# EAGLE board Bottom_PCB (EAGLE 9.7.0), part 1 of 2
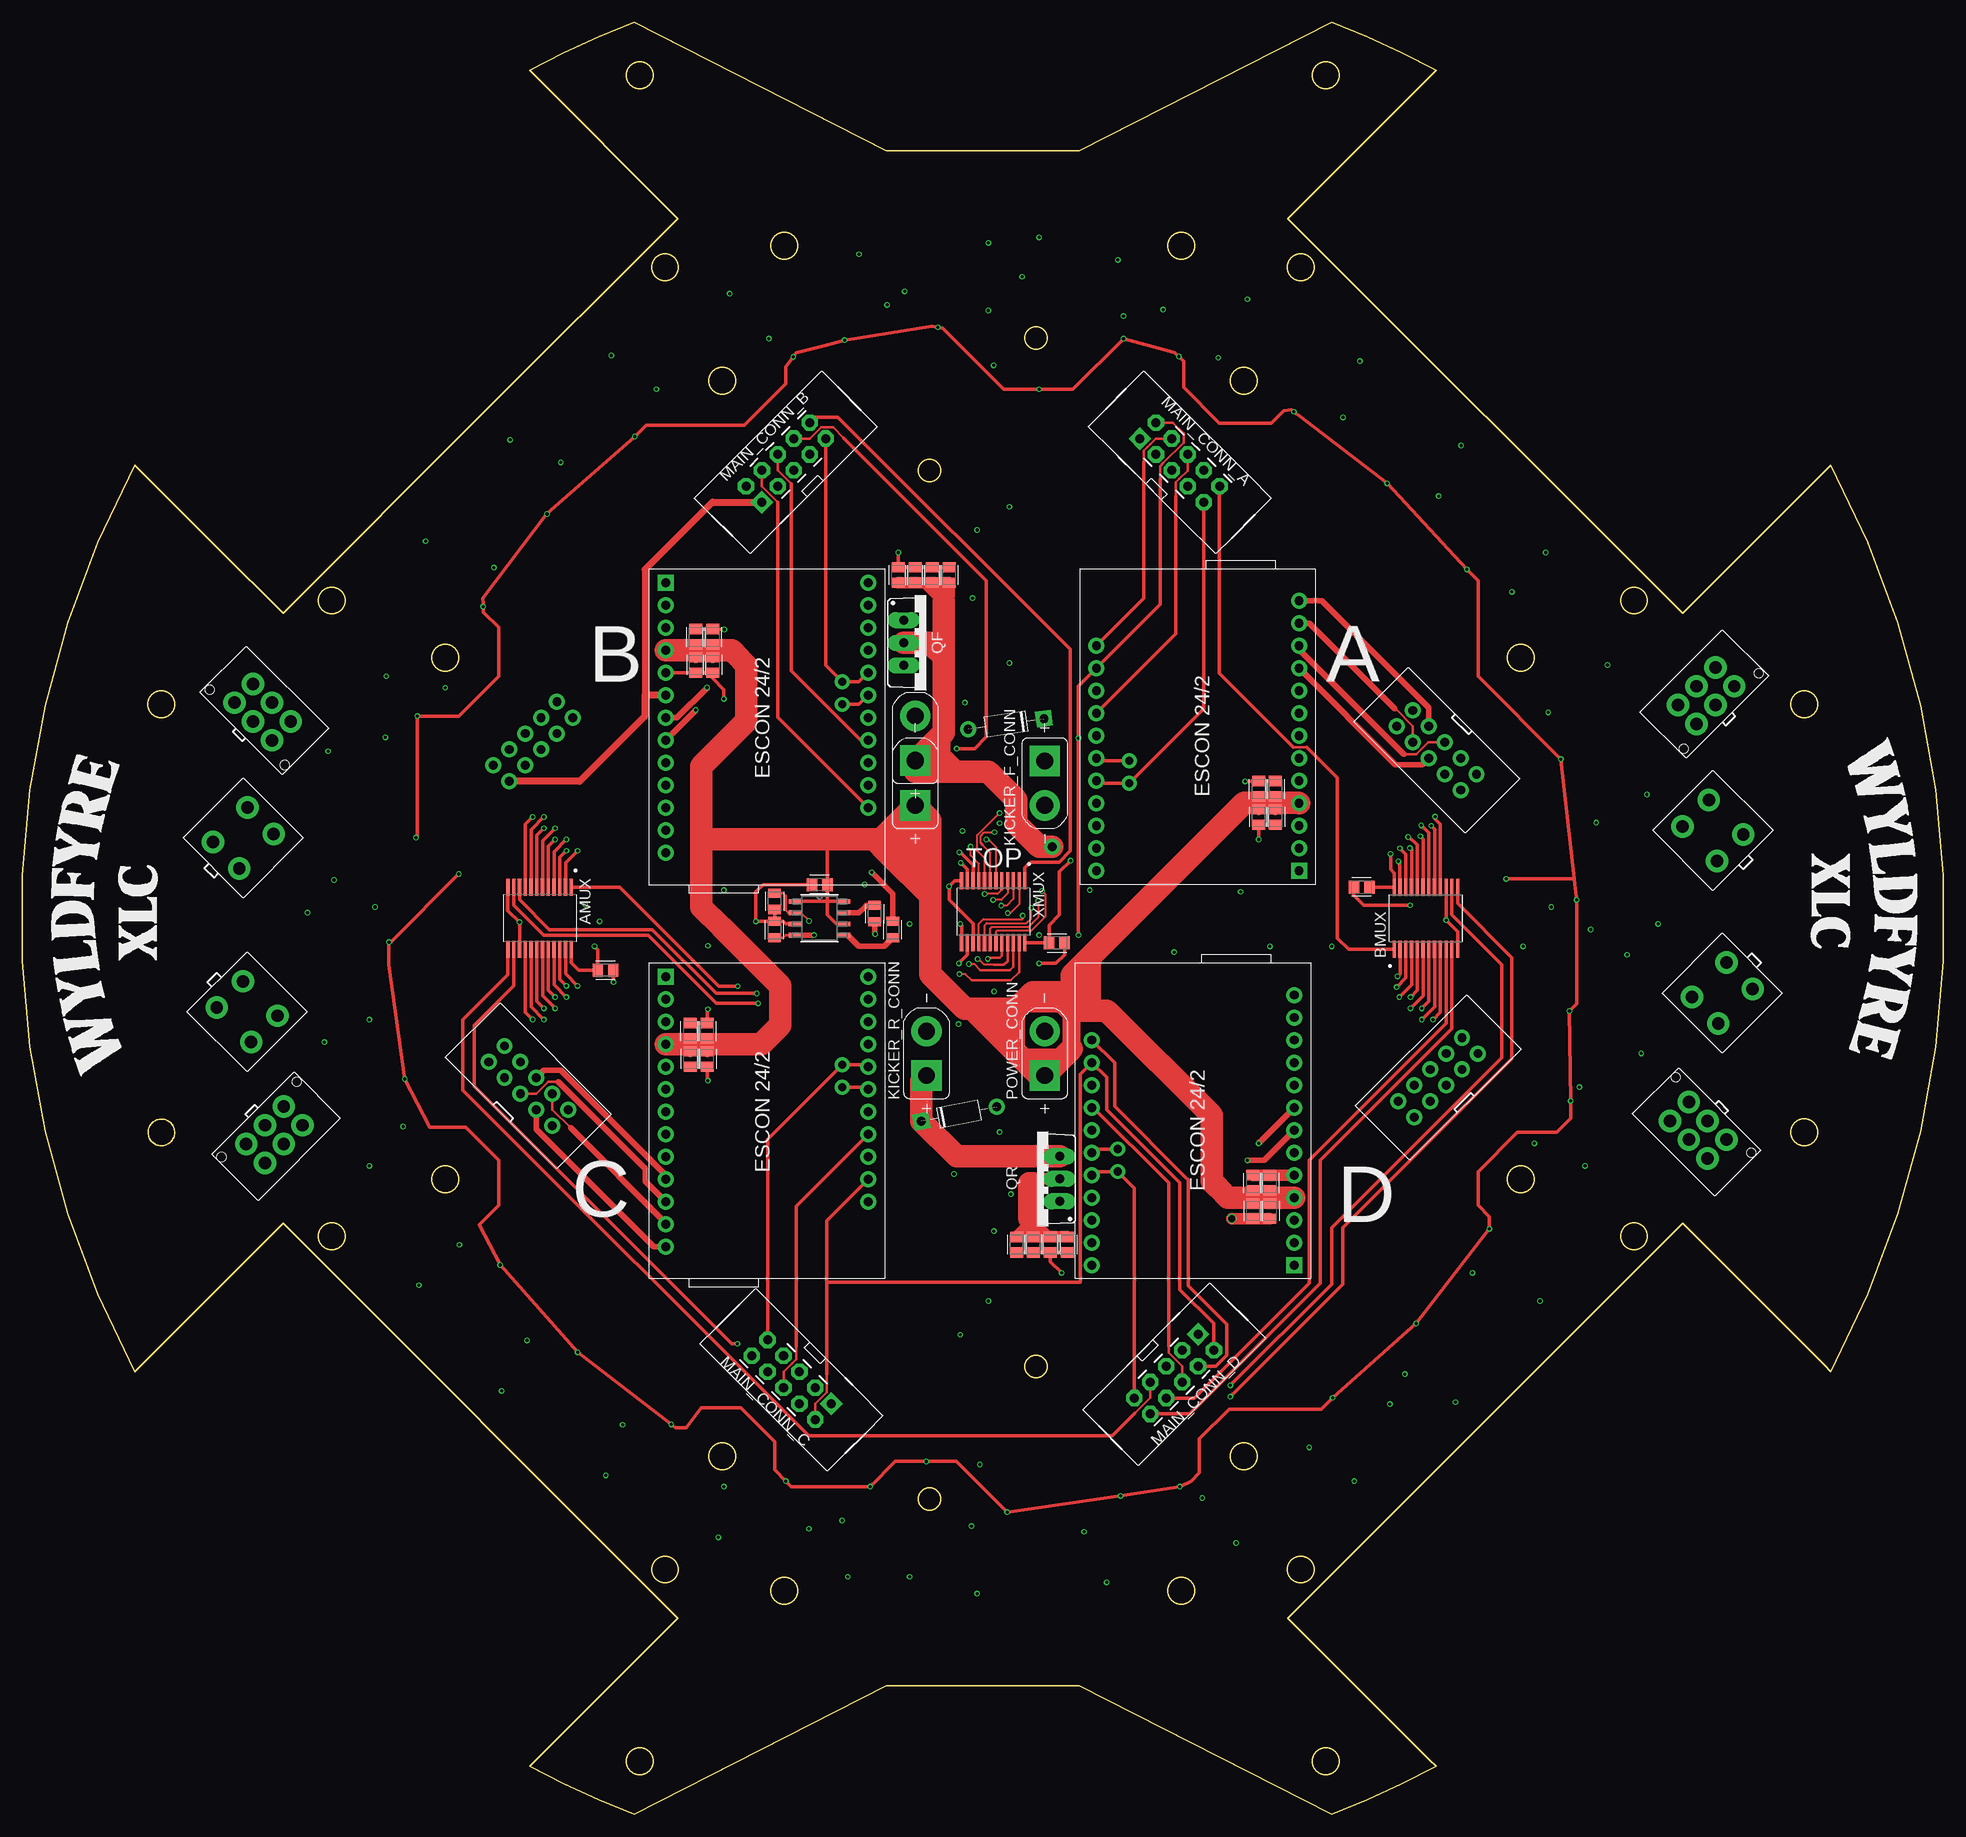
[diagram p5: board, top side]
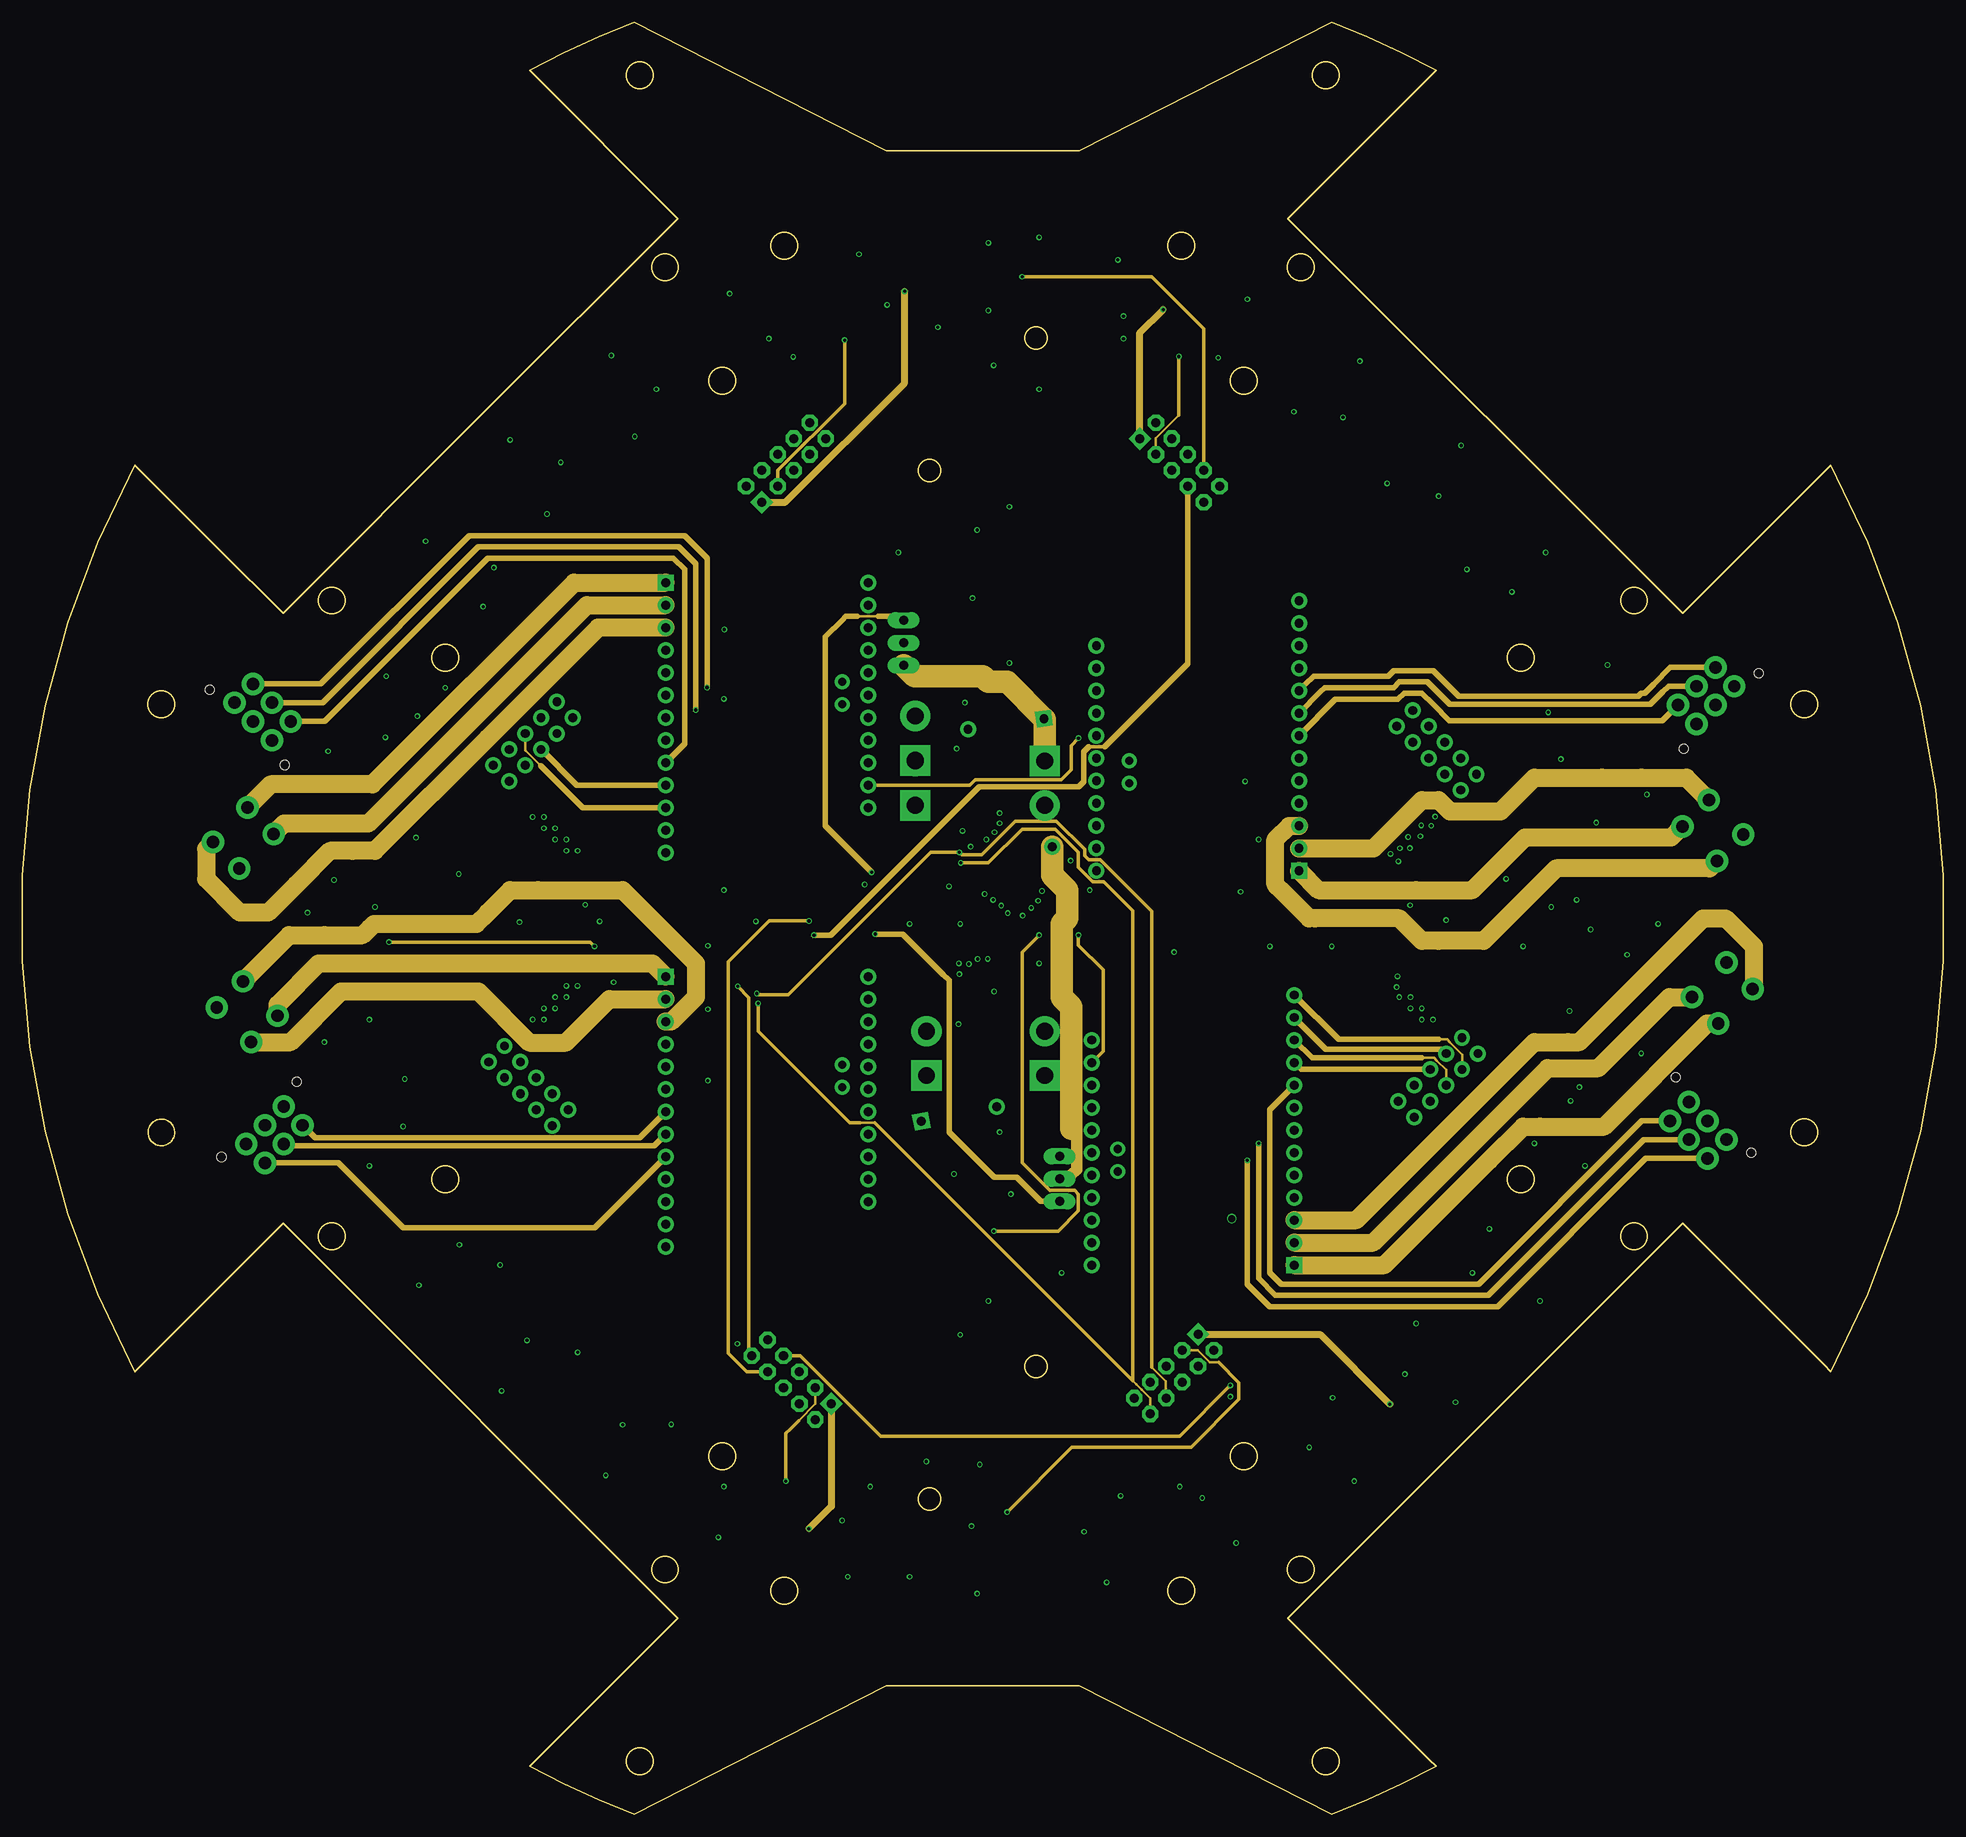
[diagram p6: board, inner layer Route2]
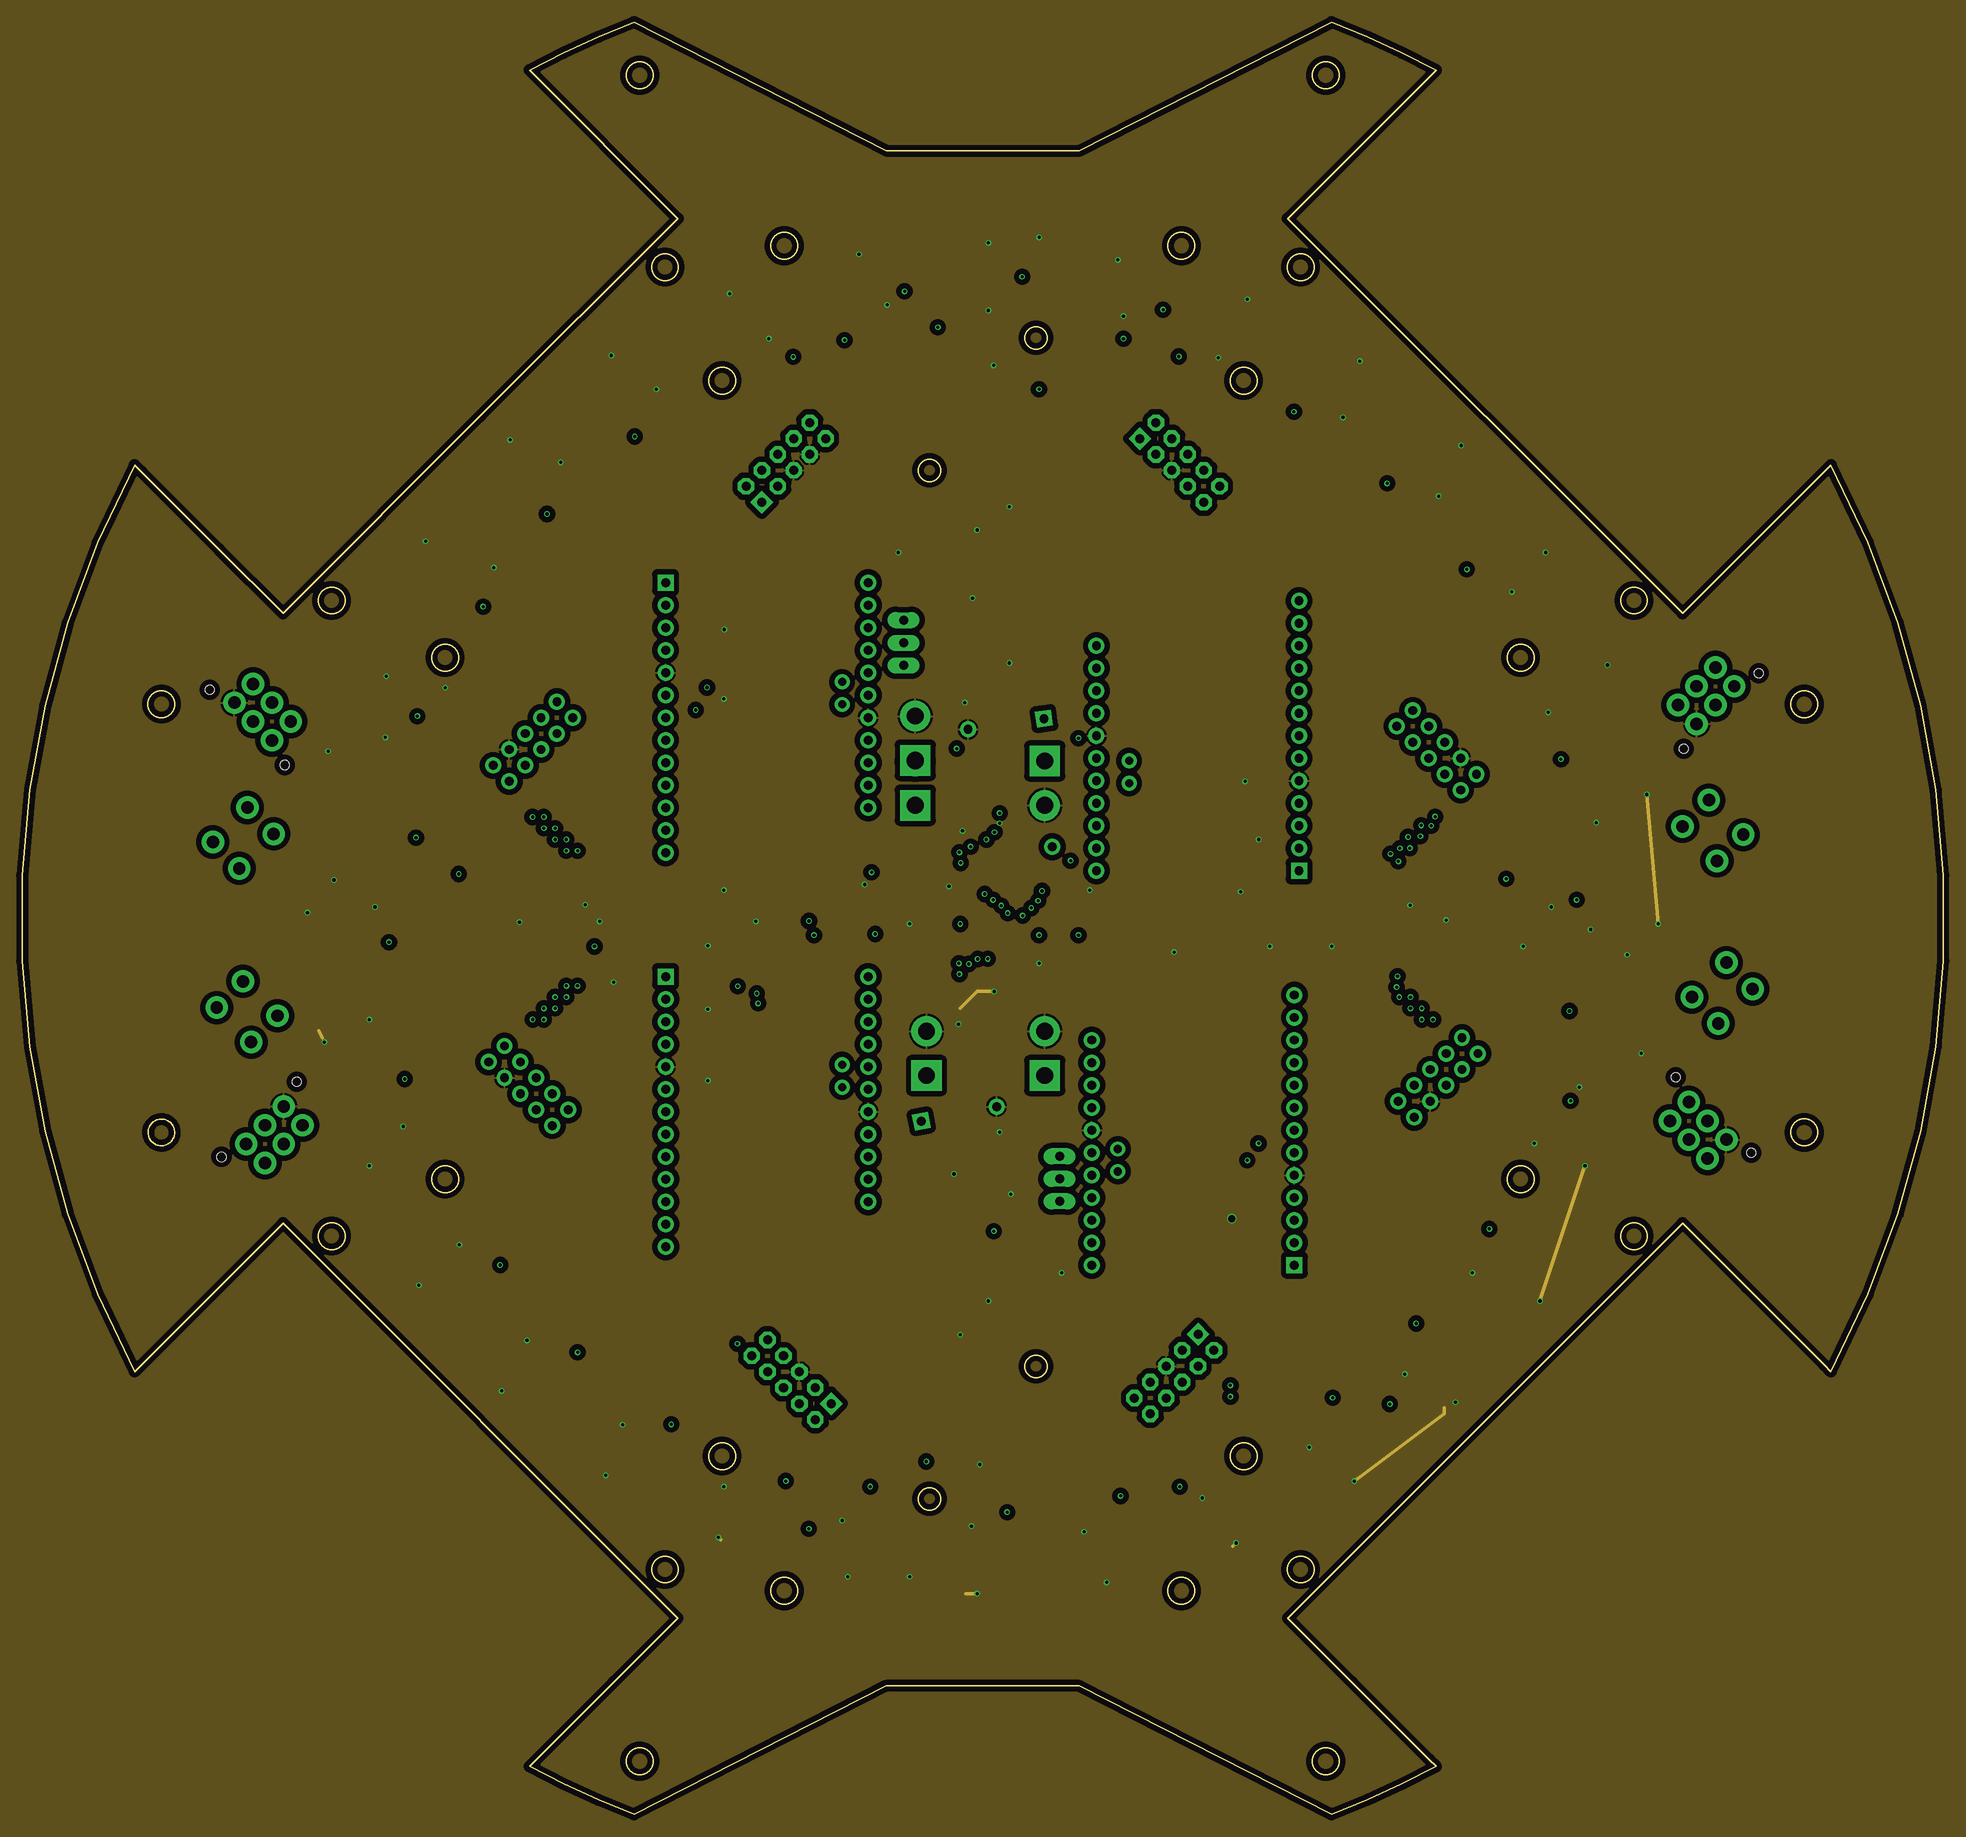
[diagram p7: board, inner layer Route15]
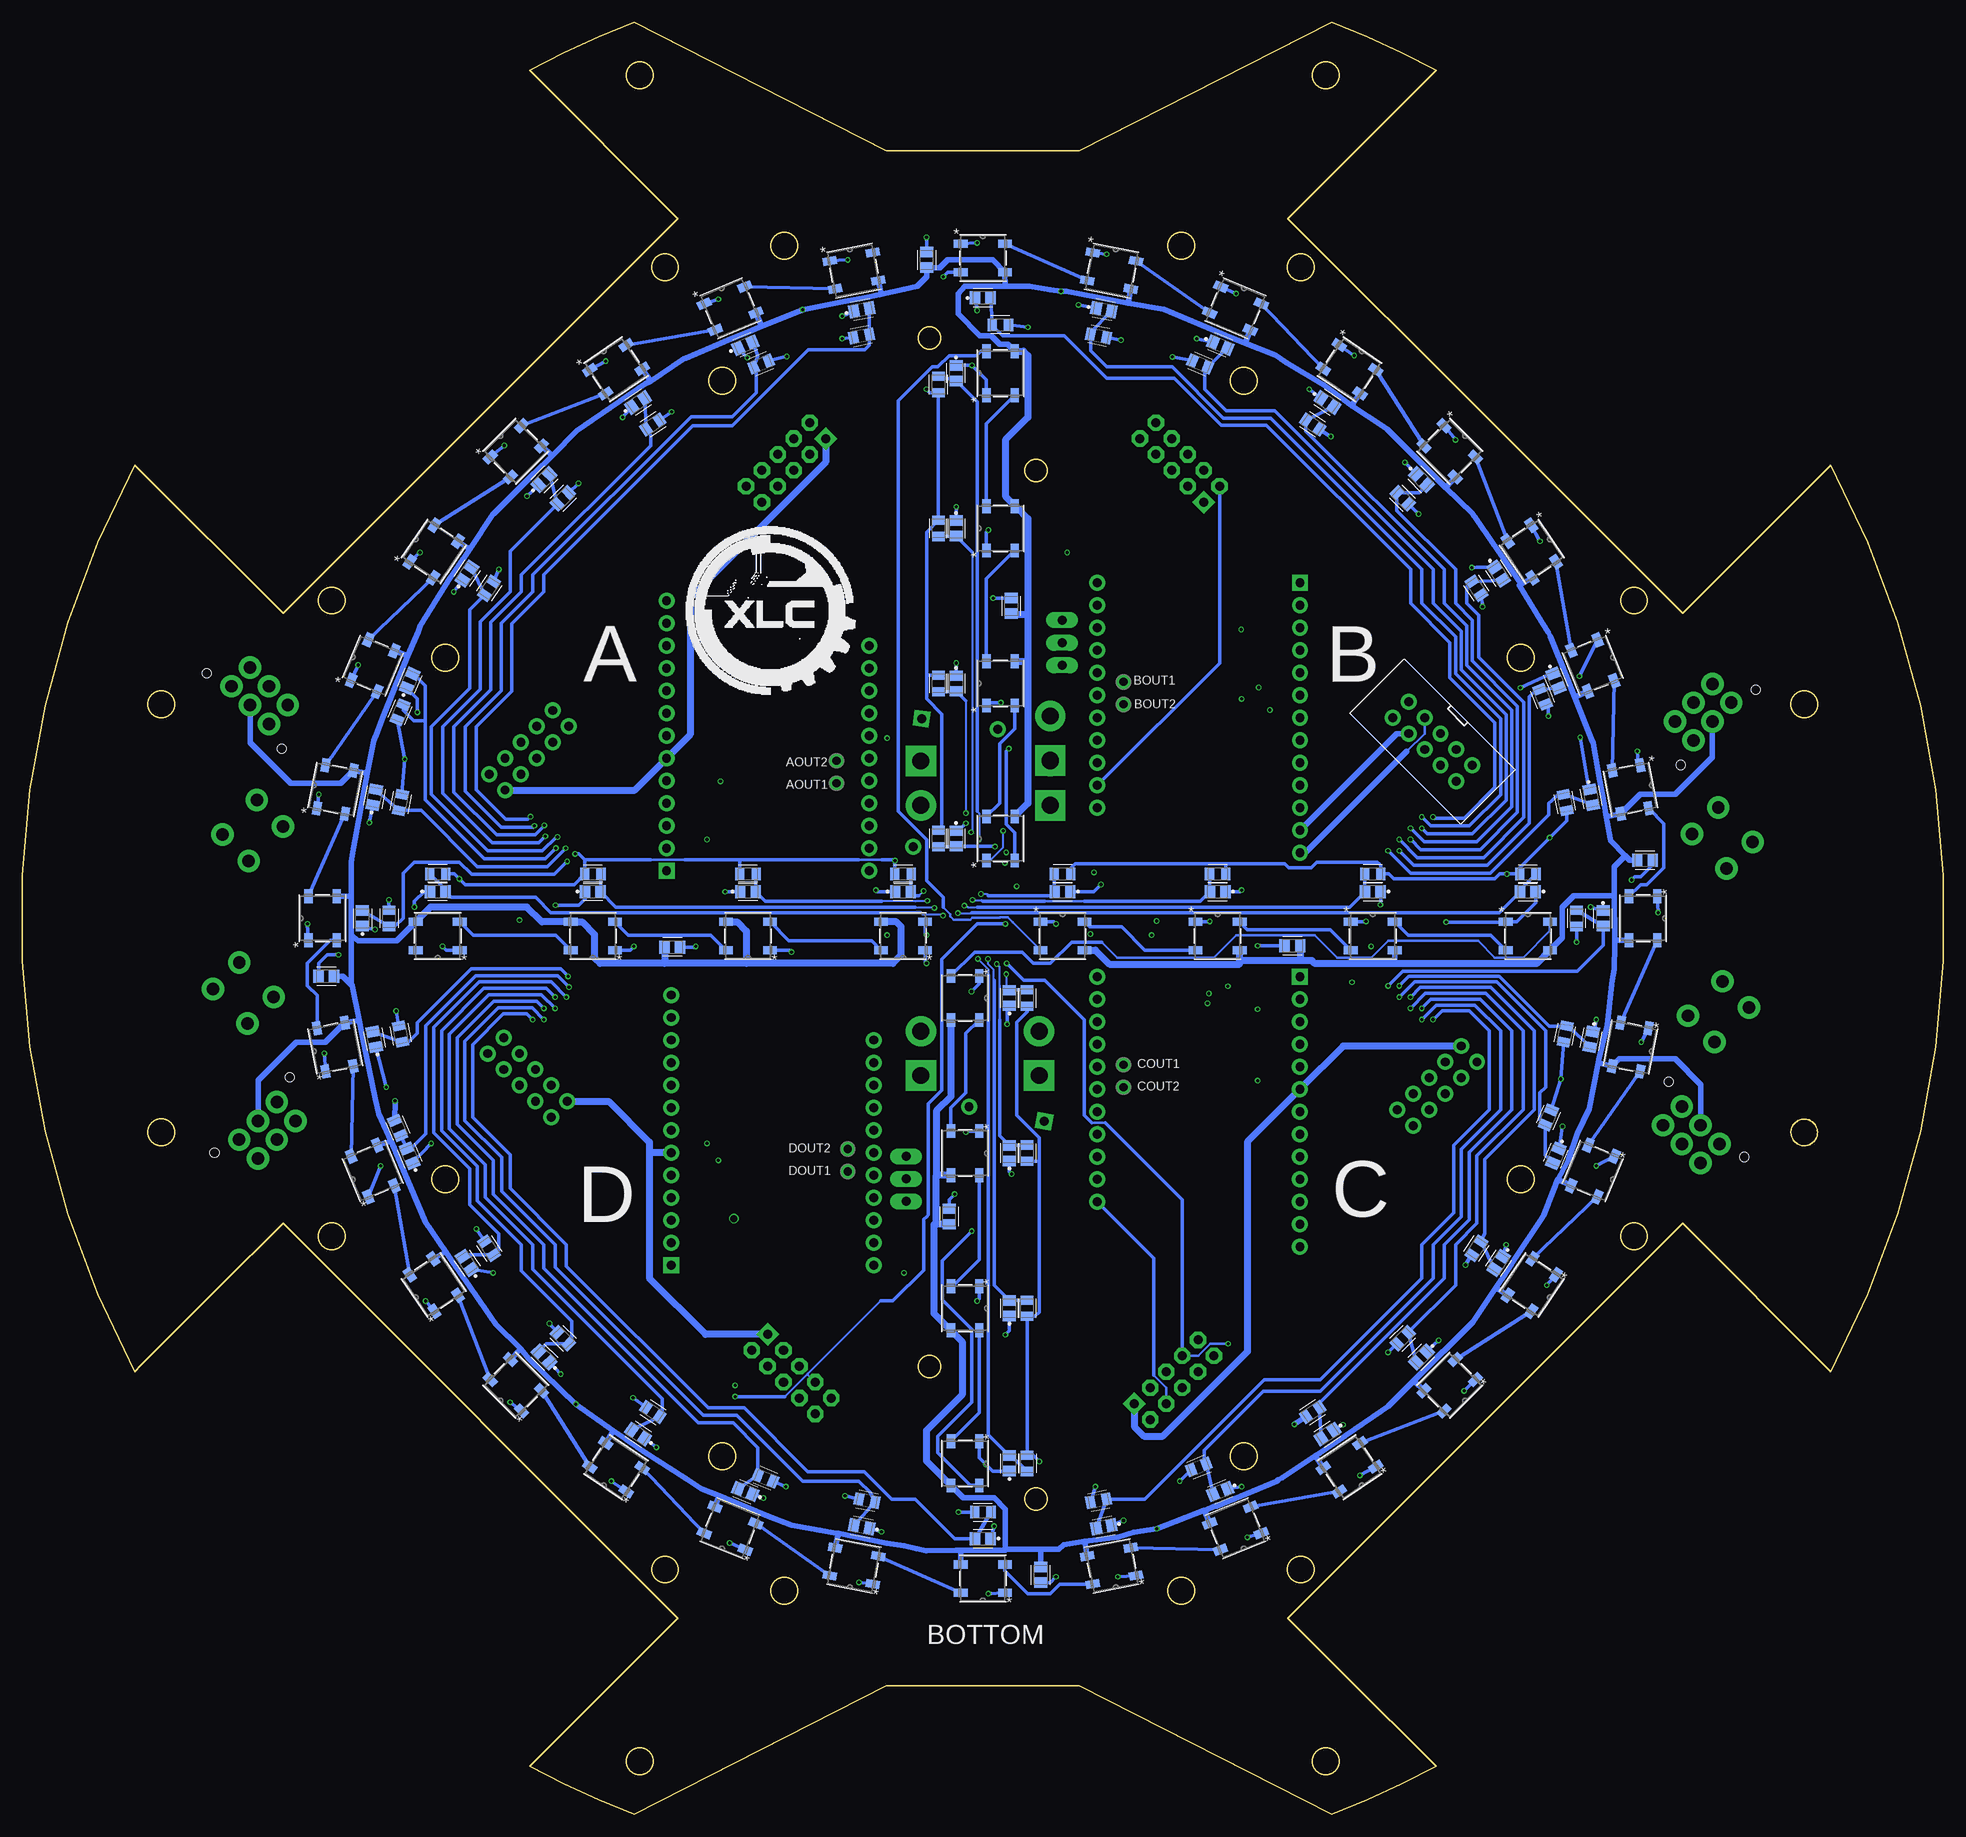
[diagram p8: board, bottom side, seen from below]

Size 216.78 x 202.22 mm. Coordinates in mm from the lower left corner, seen from the top.
Outline: 14.31,76.41 arc180 17.11,77.49 arc180 14.31,76.41
Outline: 194.58,59.47 203.33,50.73 204.08,49.97 arc56 204.08,152.26 187.35,135.52 142.8,180.07 159.54,196.8 arc7 147.74,202.22 119.3,187.72 97.49,187.72 69.04,202.22 arc7 57.25,196.8 73.99,180.07 51.71,157.79 29.44,135.52 22.2,142.76 13.46,151.5 12.7,152.26 arc56 12.7,49.97 29.44,66.71 73.97,22.14 66.75,14.92 57.99,6.16 57.25,5.42 arc7 69.04,0 97.49,14.5 119.3,14.5 147.74,0 arc7 159.54,5.42 158.78,6.18 150.04,14.92 142.82,22.14 187.35,66.71 194.58,59.47
Outline: circle at 72.54,174.59 radius 1.5
Outline: circle at 201.07,76.95 radius 1.5
Outline: circle at 181.87,136.97 radius 1.5
Outline: circle at 34.92,65.26 radius 1.5
Outline: circle at 130.81,25.23 radius 1.5
Outline: circle at 15.71,125.28 radius 1.5
Outline: circle at 72.54,27.64 radius 1.5
Outline: circle at 102.39,151.66 radius 1.25
Outline: circle at 69.69,5.99 radius 1.5
Outline: circle at 85.98,177 radius 1.5
Outline: circle at 147.09,196.23 radius 1.5
Outline: circle at 102.39,35.61 radius 1.25
Outline: circle at 144.25,27.64 radius 1.5
Outline: circle at 114.39,50.56 radius 1.25
Outline: circle at 130.81,177 radius 1.5
Outline: circle at 137.81,161.79 radius 1.5
Outline: circle at 114.39,166.61 radius 1.25
Outline: circle at 201.08,125.27 radius 1.5
Outline: circle at 169.07,71.69 radius 1.5
Outline: circle at 47.72,71.69 radius 1.5
Copper layers (1+2*15+16): Top 0.035mm / dielectric 0.2mm / Route2 0.0175mm / dielectric 1.065mm / Route15 0.0175mm / dielectric 0.2mm / Bottom 0.035mm
Design rules "jlcpcb-4layers.dru *": minimum track width 3.5mil, minimum drill 0.2mm, track to track 5mil, track to pad 0.2mm, pad to pad 5mil, via to via 0.5mm, smd to smd 5mil, copper to edge 0.2mm, drill to drill 6mil, minimum pad ring 10mil, minimum via ring 0.13mm, stop-mask expansion 0.05mm, vias tented up to drill 16mil, thermal gap 10mil
tKeepout: area 126.9,119.6 to 187.2,179.9; area 29.8,119.5 to 90,179.7; area 29.6,22.3 to 89.9,82.6; area 126.8,22.5 to 187,82.7; area 97.3,16.7 to 119.3,55.5; area 97.3,146.9 to 119.3,185.6

## Footprints (pad centres in the part's own frame; a part is rotated, then mirrored left to right if it is on the bottom)
PIN2.54-2X5 = drill 1: A1 0,0; A2 0,2.54; A3 2.54,0; A4 2.54,2.54; A5 5.08,0; A6 5.08,2.54; A7 7.62,0; A8 7.62,2.54; A9 10.16,0; A10 10.16,2.54
MX-44914-0601 = drill 1.4: B1 6,0; B2 3,0; B3 0,0; B4 6,3; B5 3,3; B6 0,3 | hole 1.04: -3,3.94; 9,3.94
ESCON24/2 = drill 1 square: 1 34.06,24.765 | drill 1: 2 31.52,24.765; 3 28.98,24.765; 4 26.44,24.765; 5 23.9,24.765; 6 21.36,24.765; 7 18.82,24.765; 8 16.28,24.765; 9 13.74,24.765; 10 11.2,24.765; 11 8.66,24.765; 12 6.12,24.765; 13 3.58,24.765; 14 8.66,1.905; 15 11.2,1.905; 16 13.74,1.905; 17 16.28,1.905; 18 18.82,1.905; 19 21.36,1.905; 20 23.9,1.905; 21 26.44,1.905; 22 28.98,1.905; 23 31.52,1.905; 24 34.06,1.905
SOP65P780X200-24N = smd 1.9 x 0.48: 1 -3.505,3.575; 2 -3.505,2.925; 3 -3.505,2.275; 4 -3.505,1.625; 5 -3.505,0.975; 6 -3.505,0.325; 7 -3.505,-0.325; 8 -3.505,-0.975; 9 -3.505,-1.625; 10 -3.505,-2.275; 11 -3.505,-2.925; 12 -3.505,-3.575; 13 3.505,-3.575; 14 3.505,-2.925; 15 3.505,-2.275; 16 3.505,-1.625; 17 3.505,-0.975; 18 3.505,-0.325; 19 3.505,0.325; 20 3.505,0.975; 21 3.505,1.625; 22 3.505,2.275; 23 3.505,2.925; 24 3.505,3.575
MX5566 = drill 1.4: C1 4.2,0; C2 0,0; C3 4.2,5.5; C4 0,5.5
TESTPOINT_PAD-036 = drill 0.914 pad 1.676: 1 0,0
AMASS_XT30UPB-M = drill 1.9: N 2.5,0 | drill 1.9 square: P -2.5,0
CAPC2012X110 = smd 1.165 x 1.465: 1 -0.875,0; 2 0.875,0
DO-41 = drill 1: A 4.325,0 | drill 1 square: C -4.325,0
LTST-E563CEGBW_LTO-M = smd 1.549 x 0.94: 1 -2.489,1.6; 2 -2.489,-1.6; 3 2.489,1.6; 4 2.489,-1.6
2X05 = drill 1.016 square: 1 -5.08,-1.27 | drill 1.016 octagon: 2 -5.08,1.27; 3 -2.54,-1.27; 4 -2.54,1.27; 5 0,-1.27; 6 0,1.27; 7 2.54,-1.27; 8 2.54,1.27; 9 5.08,-1.27; 10 5.08,1.27
SO-8_STM = smd 1.46 x 0.533: 1 -2.724,1.905; 2 -2.724,0.635; 3 -2.724,-0.635; 4 -2.724,-1.905; 5 2.724,-1.905; 6 2.724,-0.635; 7 2.724,0.635; 8 2.724,1.905
TRANS_RPM-075P_ROM = smd 1.165 x 1.465: 1 -0.875,0; 2 0.875,0
TO220BV = drill 1.016 long: D 0,-2.54; G -2.54,-2.54; S 2.54,-2.54
RESC2012X65 = smd 1.031 x 1.42: 1 -0.919,0; 2 0.919,0

## Placement (x,y rotation side)
AENC  PIN2.54-2X5  [PIN2.54-2X5]  164.1,117.38 135 top
AHAL  MX-44914-0601  [MX-44914-0601]  191.06,129.41 225 top
AMD  ESCON24/224/2  [ESCON24/2]  119.31,140.52 270 top
AMUX  CD74HC4067SM96  [SOP65P780X200-24N]  58.39,101.11 270 top
AMW  MX5566  [MX5566]  190.31,114.45 225 top
AOUT1  TESTPOINT_TPS-PAD-036  [TESTPOINT_PAD-036]  124.9,116.35 0 bottom
AOUT2  TESTPOINT_TPS-PAD-036  [TESTPOINT_PAD-036]  124.9,118.89 0 bottom
BENC  PIN2.54-2X5  [PIN2.54-2X5]  53.16,118.37 135 bottom
BHAL  MX-44914-0601  [MX-44914-0601]  30.31,123.32 135 top
BMD  ESCON24/224/2  [ESCON24/2]  97.36,104.92 90 top
BMUX  CD74HC4067SM96  [SOP65P780X200-24N]  158.39,101.11 90 top
BMW  MX5566  [MX5566]  28.38,110.64 135 top
BOOST_IN  XT30UPB-M  [AMASS_XT30UPB-M]  100.77,116.35 90 top
BOOST_OUT  XT30UPB-M  [AMASS_XT30UPB-M]  100.77,121.43 90 top
BOUT1  TESTPOINT_TPS-PAD-036  [TESTPOINT_PAD-036]  92.52,127.78 0 bottom
BOUT2  TESTPOINT_TPS-PAD-036  [TESTPOINT_PAD-036]  92.52,125.24 0 bottom
C1  100n  [CAPC2012X110]  101.86,27.03 270 bottom
C9  100n  [CAPC2012X110]  182.47,94.58 180 bottom
C17  100n  [CAPC2012X110]  114.74,175.41 90 bottom
C25  100n  [CAPC2012X110]  33.68,107.65 0 bottom
C101  100n  [CAPC2012X110]  105.2,136.37 90 bottom
C105  100n  [CAPC2012X110]  73.46,98.02 180 bottom
C109  100n  [CAPC2012X110]  112.2,67.46 90 bottom
C113  100n  [CAPC2012X110]  143.43,97.86 0 bottom
C201  100n  [CAPC2012X110]  141.41,115.72 270 top
C202  100n  [CAPC2012X110]  141.41,112.54 90 top
C203  100n  [CAPC2012X110]  139.51,115.72 270 top
C204  100n  [CAPC2012X110]  139.51,112.54 90 top
C205  100n  [CAPC2012X110]  77.91,129.69 90 top
C206  100n  [CAPC2012X110]  77.91,132.86 270 top
C207  100n  [CAPC2012X110]  76.01,129.69 90 top
C208  100n  [CAPC2012X110]  76.01,132.86 270 top
C209  100n  [CAPC2012X110]  77.28,85.24 90 top
C210  100n  [CAPC2012X110]  75.37,85.24 90 top
C211  100n  [CAPC2012X110]  75.37,88.41 270 top
C212  100n  [CAPC2012X110]  77.28,88.41 270 top
C213  100n  [CAPC2012X110]  65.83,95.27 180 top
C214  100n  [CAPC2012X110]  151.14,104.62 0 top
C215  100n  [CAPC2012X110]  138.87,68.09 90 top
C216  100n  [CAPC2012X110]  140.78,68.09 90 top
C217  100n  [CAPC2012X110]  138.87,71.27 270 top
C218  100n  [CAPC2012X110]  140.78,71.27 270 top
C219  100n  [CAPC2012X110]  89.98,104.92 0 top
C220  100n  [CAPC2012X110]  116.75,98.34 180 top
C221  100n  [CAPC2012X110]  104.58,139.85 270 top
C222  100n  [CAPC2012X110]  102.68,139.85 270 top
C223  100n  [CAPC2012X110]  98.87,139.85 270 top
C224  100n  [CAPC2012X110]  100.77,139.85 270 top
C225  100n  [CAPC2012X110]  117.92,64.28 90 top
C226  100n  [CAPC2012X110]  114.11,64.28 90 top
C227  100n  [CAPC2012X110]  112.2,64.28 90 top
C228  100n  [CAPC2012X110]  116.01,64.28 90 top
CENC  PIN2.54-2X5  [PIN2.54-2X5]  52.63,84.9 315 top
CHAL  MX-44914-0601  [MX-44914-0601]  27.4,73.52 45 top
CMD  ESCON24/224/2  [ESCON24/2]  97.37,60.47 90 top
CMW  MX5566  [MX5566]  25.84,87.14 45 top
COUT1  TESTPOINT_TPS-PAD-036  [TESTPOINT_PAD-036]  92.52,84.6 180 bottom
COUT2  TESTPOINT_TPS-PAD-036  [TESTPOINT_PAD-036]  92.52,82.06 180 bottom
D1  1N4740A-TR  [DO-41]  105.7,79.04 11 top
D2  1N4740A-TR  [DO-41]  111.01,123.03 188 top
DENC  PIN2.54-2X5  [PIN2.54-2X5]  157.07,78.67 45 top
DHAL  MX-44914-0601  [MX-44914-0601]  185.93,78.25 315 top
DMD  ESCON24/224/2  [ESCON24/2]  118.79,96.03 270 top
DMW  MX5566  [MX5566]  188.4,92.22 315 top
DOUT1  TESTPOINT_TPS-PAD-036  [TESTPOINT_PAD-036]  123.63,72.54 180 bottom
DOUT2  TESTPOINT_TPS-PAD-036  [TESTPOINT_PAD-036]  123.63,75.08 180 bottom
KICKER_F_CONN  XT30UPB-M  [AMASS_XT30UPB-M]  115.38,116.35 270 top
KICKER_R_CONN  XT30UPB-M  [AMASS_XT30UPB-M]  102.04,85.87 90 top
LED0  LTST-E563CEGBWLTST-E563CEGBW_LTO-M  [LTST-E563CEGBW_LTO-M]  108.39,175.61 0 bottom
LED1  LTST-E563CEGBWLTST-E563CEGBW_LTO-M  [LTST-E563CEGBW_LTO-M]  93.86,174.18 349 bottom
LED2  LTST-E563CEGBWLTST-E563CEGBW_LTO-M  [LTST-E563CEGBW_LTO-M]  79.88,169.94 337 bottom
LED3  LTST-E563CEGBWLTST-E563CEGBW_LTO-M  [LTST-E563CEGBW_LTO-M]  67,163.06 326 bottom
LED4  LTST-E563CEGBWLTST-E563CEGBW_LTO-M  [LTST-E563CEGBW_LTO-M]  55.71,153.79 315 bottom
LED5  LTST-E563CEGBWLTST-E563CEGBW_LTO-M  [LTST-E563CEGBW_LTO-M]  46.45,142.5 304 bottom
LED6  LTST-E563CEGBWLTST-E563CEGBW_LTO-M  [LTST-E563CEGBW_LTO-M]  39.56,129.62 292 bottom
LED7  LTST-E563CEGBWLTST-E563CEGBW_LTO-M  [LTST-E563CEGBW_LTO-M]  35.32,115.65 281 bottom
LED8  LTST-E563CEGBWLTST-E563CEGBW_LTO-M  [LTST-E563CEGBW_LTO-M]  33.89,101.11 270 bottom
LED9  LTST-E563CEGBWLTST-E563CEGBW_LTO-M  [LTST-E563CEGBW_LTO-M]  35.32,86.58 259 bottom
LED10  LTST-E563CEGBWLTST-E563CEGBW_LTO-M  [LTST-E563CEGBW_LTO-M]  39.56,72.6 247 bottom
LED11  LTST-E563CEGBWLTST-E563CEGBW_LTO-M  [LTST-E563CEGBW_LTO-M]  46.45,59.72 236 bottom
LED12  LTST-E563CEGBWLTST-E563CEGBW_LTO-M  [LTST-E563CEGBW_LTO-M]  55.71,48.43 225 bottom
LED13  LTST-E563CEGBWLTST-E563CEGBW_LTO-M  [LTST-E563CEGBW_LTO-M]  67,39.17 214 bottom
LED14  LTST-E563CEGBWLTST-E563CEGBW_LTO-M  [LTST-E563CEGBW_LTO-M]  79.88,32.28 202 bottom
LED15  LTST-E563CEGBWLTST-E563CEGBW_LTO-M  [LTST-E563CEGBW_LTO-M]  93.86,28.04 191 bottom
LED16  LTST-E563CEGBWLTST-E563CEGBW_LTO-M  [LTST-E563CEGBW_LTO-M]  108.39,26.61 180 bottom
LED17  LTST-E563CEGBWLTST-E563CEGBW_LTO-M  [LTST-E563CEGBW_LTO-M]  122.93,28.04 169 bottom
LED18  LTST-E563CEGBWLTST-E563CEGBW_LTO-M  [LTST-E563CEGBW_LTO-M]  136.9,32.28 158 bottom
LED19  LTST-E563CEGBWLTST-E563CEGBW_LTO-M  [LTST-E563CEGBW_LTO-M]  149.78,39.17 146 bottom
LED20  LTST-E563CEGBWLTST-E563CEGBW_LTO-M  [LTST-E563CEGBW_LTO-M]  161.07,48.43 135 bottom
LED21  LTST-E563CEGBWLTST-E563CEGBW_LTO-M  [LTST-E563CEGBW_LTO-M]  170.34,59.72 124 bottom
LED22  LTST-E563CEGBWLTST-E563CEGBW_LTO-M  [LTST-E563CEGBW_LTO-M]  177.22,72.6 113 bottom
LED23  LTST-E563CEGBWLTST-E563CEGBW_LTO-M  [LTST-E563CEGBW_LTO-M]  181.46,86.58 101 bottom
LED24  LTST-E563CEGBWLTST-E563CEGBW_LTO-M  [LTST-E563CEGBW_LTO-M]  182.89,101.11 90 bottom
LED25  LTST-E563CEGBWLTST-E563CEGBW_LTO-M  [LTST-E563CEGBW_LTO-M]  181.46,115.65 79 bottom
LED26  LTST-E563CEGBWLTST-E563CEGBW_LTO-M  [LTST-E563CEGBW_LTO-M]  177.22,129.62 67 bottom
LED27  LTST-E563CEGBWLTST-E563CEGBW_LTO-M  [LTST-E563CEGBW_LTO-M]  170.34,142.5 56 bottom
LED28  LTST-E563CEGBWLTST-E563CEGBW_LTO-M  [LTST-E563CEGBW_LTO-M]  161.07,153.79 45 bottom
LED29  LTST-E563CEGBWLTST-E563CEGBW_LTO-M  [LTST-E563CEGBW_LTO-M]  149.78,163.06 34 bottom
LED30  LTST-E563CEGBWLTST-E563CEGBW_LTO-M  [LTST-E563CEGBW_LTO-M]  136.9,169.94 23 bottom
LED31  LTST-E563CEGBWLTST-E563CEGBW_LTO-M  [LTST-E563CEGBW_LTO-M]  122.93,174.18 11 bottom
LED32  LTST-E563CEGBWLTST-E563CEGBW_LTO-M  [LTST-E563CEGBW_LTO-M]  106.39,110.11 90 bottom
LED33  LTST-E563CEGBWLTST-E563CEGBW_LTO-M  [LTST-E563CEGBW_LTO-M]  106.39,127.61 90 bottom
LED34  LTST-E563CEGBWLTST-E563CEGBW_LTO-M  [LTST-E563CEGBW_LTO-M]  106.39,145.11 90 bottom
LED35  LTST-E563CEGBWLTST-E563CEGBW_LTO-M  [LTST-E563CEGBW_LTO-M]  106.39,162.61 90 bottom
LED36  LTST-E563CEGBWLTST-E563CEGBW_LTO-M  [LTST-E563CEGBW_LTO-M]  99.39,99.11 0 bottom
LED37  LTST-E563CEGBWLTST-E563CEGBW_LTO-M  [LTST-E563CEGBW_LTO-M]  81.89,99.11 0 bottom
LED38  LTST-E563CEGBWLTST-E563CEGBW_LTO-M  [LTST-E563CEGBW_LTO-M]  64.39,99.11 0 bottom
LED39  LTST-E563CEGBWLTST-E563CEGBW_LTO-M  [LTST-E563CEGBW_LTO-M]  46.89,99.11 0 bottom
LED40  LTST-E563CEGBWLTST-E563CEGBW_LTO-M  [LTST-E563CEGBW_LTO-M]  110.39,92.11 270 bottom
LED41  LTST-E563CEGBWLTST-E563CEGBW_LTO-M  [LTST-E563CEGBW_LTO-M]  110.39,74.61 270 bottom
LED42  LTST-E563CEGBWLTST-E563CEGBW_LTO-M  [LTST-E563CEGBW_LTO-M]  110.39,57.11 270 bottom
LED43  LTST-E563CEGBWLTST-E563CEGBW_LTO-M  [LTST-E563CEGBW_LTO-M]  110.39,39.61 270 bottom
LED44  LTST-E563CEGBWLTST-E563CEGBW_LTO-M  [LTST-E563CEGBW_LTO-M]  117.39,99.11 180 bottom
LED45  LTST-E563CEGBWLTST-E563CEGBW_LTO-M  [LTST-E563CEGBW_LTO-M]  134.89,99.11 180 bottom
LED46  LTST-E563CEGBWLTST-E563CEGBW_LTO-M  [LTST-E563CEGBW_LTO-M]  152.39,99.11 180 bottom
LED47  LTST-E563CEGBWLTST-E563CEGBW_LTO-M  [LTST-E563CEGBW_LTO-M]  169.89,99.11 180 bottom
MAIN_CONN_A  PINHD-2X5PIXY  [2X05]  130.62,152.55 315 top
MAIN_CONN_B  PINHD-2X5PIXY  [2X05]  86.17,152.55 45 top
MAIN_CONN_C  PINHD-2X5PIXY  [2X05]  86.8,49.04 135 top
MAIN_CONN_D  PINHD-2X5PIXY  [2X05]  129.98,49.68 225 top
MOSDRIVER  PM8834TRSO-8_STM  [SO-8_STM]  89.98,101.11 0 top
PHOTO0  RPM-075PTT86TRANS_RPM-075P_ROM  [TRANS_RPM-075P_ROM]  108.39,171.11 0 bottom
PHOTO1  RPM-075PTT86TRANS_RPM-075P_ROM  [TRANS_RPM-075P_ROM]  94.74,169.77 349 bottom
PHOTO2  RPM-075PTT86TRANS_RPM-075P_ROM  [TRANS_RPM-075P_ROM]  81.6,165.78 337 bottom
PHOTO3  RPM-075PTT86TRANS_RPM-075P_ROM  [TRANS_RPM-075P_ROM]  69.5,159.32 326 bottom
PHOTO4  RPM-075PTT86TRANS_RPM-075P_ROM  [TRANS_RPM-075P_ROM]  58.89,150.61 315 bottom
PHOTO5  RPM-075PTT86TRANS_RPM-075P_ROM  [TRANS_RPM-075P_ROM]  50.19,140 304 bottom
PHOTO6  RPM-075PTT86TRANS_RPM-075P_ROM  [TRANS_RPM-075P_ROM]  43.72,127.9 292 bottom
PHOTO7  RPM-075PTT86TRANS_RPM-075P_ROM  [TRANS_RPM-075P_ROM]  39.74,114.77 281 bottom
PHOTO8  RPM-075PTT86TRANS_RPM-075P_ROM  [TRANS_RPM-075P_ROM]  38.39,101.11 270 bottom
PHOTO9  RPM-075PTT86TRANS_RPM-075P_ROM  [TRANS_RPM-075P_ROM]  39.74,87.46 259 bottom
PHOTO10  RPM-075PTT86TRANS_RPM-075P_ROM  [TRANS_RPM-075P_ROM]  43.72,74.32 247 bottom
PHOTO11  RPM-075PTT86TRANS_RPM-075P_ROM  [TRANS_RPM-075P_ROM]  50.19,62.22 236 bottom
PHOTO12  RPM-075PTT86TRANS_RPM-075P_ROM  [TRANS_RPM-075P_ROM]  58.89,51.61 225 bottom
PHOTO13  RPM-075PTT86TRANS_RPM-075P_ROM  [TRANS_RPM-075P_ROM]  69.5,42.91 214 bottom
PHOTO14  RPM-075PTT86TRANS_RPM-075P_ROM  [TRANS_RPM-075P_ROM]  81.6,36.44 202 bottom
PHOTO15  RPM-075PTT86TRANS_RPM-075P_ROM  [TRANS_RPM-075P_ROM]  94.74,32.46 191 bottom
PHOTO16  RPM-075PTT86TRANS_RPM-075P_ROM  [TRANS_RPM-075P_ROM]  108.39,31.11 180 bottom
PHOTO17  RPM-075PTT86TRANS_RPM-075P_ROM  [TRANS_RPM-075P_ROM]  122.05,32.46 169 bottom
PHOTO18  RPM-075PTT86TRANS_RPM-075P_ROM  [TRANS_RPM-075P_ROM]  135.18,36.44 158 bottom
PHOTO19  RPM-075PTT86TRANS_RPM-075P_ROM  [TRANS_RPM-075P_ROM]  147.28,42.91 146 bottom
PHOTO20  RPM-075PTT86TRANS_RPM-075P_ROM  [TRANS_RPM-075P_ROM]  157.89,51.61 135 bottom
PHOTO21  RPM-075PTT86TRANS_RPM-075P_ROM  [TRANS_RPM-075P_ROM]  166.59,62.22 124 bottom
PHOTO22  RPM-075PTT86TRANS_RPM-075P_ROM  [TRANS_RPM-075P_ROM]  173.06,74.32 113 bottom
PHOTO23  RPM-075PTT86TRANS_RPM-075P_ROM  [TRANS_RPM-075P_ROM]  177.05,87.46 101 bottom
PHOTO24  RPM-075PTT86TRANS_RPM-075P_ROM  [TRANS_RPM-075P_ROM]  178.39,101.11 90 bottom
PHOTO25  RPM-075PTT86TRANS_RPM-075P_ROM  [TRANS_RPM-075P_ROM]  177.05,114.77 79 bottom
PHOTO26  RPM-075PTT86TRANS_RPM-075P_ROM  [TRANS_RPM-075P_ROM]  173.06,127.9 67 bottom
PHOTO27  RPM-075PTT86TRANS_RPM-075P_ROM  [TRANS_RPM-075P_ROM]  166.59,140 56 bottom
PHOTO28  RPM-075PTT86TRANS_RPM-075P_ROM  [TRANS_RPM-075P_ROM]  157.89,150.61 45 bottom
PHOTO29  RPM-075PTT86TRANS_RPM-075P_ROM  [TRANS_RPM-075P_ROM]  147.28,159.32 34 bottom
PHOTO30  RPM-075PTT86TRANS_RPM-075P_ROM  [TRANS_RPM-075P_ROM]  135.18,165.78 23 bottom
PHOTO31  RPM-075PTT86TRANS_RPM-075P_ROM  [TRANS_RPM-075P_ROM]  122.05,169.77 11 bottom
PHOTO32  RPM-075PTT86TRANS_RPM-075P_ROM  [TRANS_RPM-075P_ROM]  111.39,110.11 270 bottom
PHOTO33  RPM-075PTT86TRANS_RPM-075P_ROM  [TRANS_RPM-075P_ROM]  111.39,127.61 270 bottom
PHOTO34  RPM-075PTT86TRANS_RPM-075P_ROM  [TRANS_RPM-075P_ROM]  111.39,145.11 270 bottom
PHOTO35  RPM-075PTT86TRANS_RPM-075P_ROM  [TRANS_RPM-075P_ROM]  111.39,162.61 270 bottom
PHOTO36  RPM-075PTT86TRANS_RPM-075P_ROM  [TRANS_RPM-075P_ROM]  99.39,104.11 180 bottom
PHOTO37  RPM-075PTT86TRANS_RPM-075P_ROM  [TRANS_RPM-075P_ROM]  81.89,104.11 180 bottom
PHOTO38  RPM-075PTT86TRANS_RPM-075P_ROM  [TRANS_RPM-075P_ROM]  64.39,104.11 180 bottom
PHOTO39  RPM-075PTT86TRANS_RPM-075P_ROM  [TRANS_RPM-075P_ROM]  46.89,104.11 180 bottom
PHOTO40  RPM-075PTT86TRANS_RPM-075P_ROM  [TRANS_RPM-075P_ROM]  105.39,92.11 90 bottom
PHOTO41  RPM-075PTT86TRANS_RPM-075P_ROM  [TRANS_RPM-075P_ROM]  105.39,74.61 90 bottom
PHOTO42  RPM-075PTT86TRANS_RPM-075P_ROM  [TRANS_RPM-075P_ROM]  105.39,57.11 90 bottom
PHOTO43  RPM-075PTT86TRANS_RPM-075P_ROM  [TRANS_RPM-075P_ROM]  105.39,39.61 90 bottom
PHOTO44  RPM-075PTT86TRANS_RPM-075P_ROM  [TRANS_RPM-075P_ROM]  117.39,104.11 0 bottom
PHOTO45  RPM-075PTT86TRANS_RPM-075P_ROM  [TRANS_RPM-075P_ROM]  134.89,104.11 0 bottom
PHOTO46  RPM-075PTT86TRANS_RPM-075P_ROM  [TRANS_RPM-075P_ROM]  152.39,104.11 0 bottom
PHOTO47  RPM-075PTT86TRANS_RPM-075P_ROM  [TRANS_RPM-075P_ROM]  169.89,104.11 0 bottom
POWER_CONN  XT30UPB-M  [AMASS_XT30UPB-M]  115.38,85.87 90 top
QF  IRF520  [TO220BV]  101.99,132.2 270 top
QR  IRF520  [TO220BV]  114.51,71.7 90 top
R0  10k  [RESC2012X65]  106.41,168.07 0 bottom
R1  10k  [RESC2012X65]  95.32,166.82 349 bottom
R2  10k  [RESC2012X65]  83.87,163.67 157 bottom
R3  10k  [RESC2012X65]  71.17,156.82 326 bottom
R4  10k  [RESC2012X65]  61.02,148.49 315 bottom
R5  10k  [RESC2012X65]  52.68,138.34 304 bottom
R6  10k  [RESC2012X65]  45.22,126.12 292 bottom
R7  10k  [RESC2012X65]  42.68,114.18 281 bottom
R8  10k  [RESC2012X65]  41.39,101.11 270 bottom
R9  10k  [RESC2012X65]  42.68,88.04 259 bottom
R10  10k  [RESC2012X65]  44.59,78.65 67 bottom
R11  10k  [RESC2012X65]  52.68,63.89 236 bottom
R12  10k  [RESC2012X65]  61.02,53.74 225 bottom
R13  10k  [RESC2012X65]  71.17,45.4 214 bottom
R14  10k  [RESC2012X65]  84.02,39.21 202 bottom
R15  10k  [RESC2012X65]  95.32,35.4 191 bottom
R16  10k  [RESC2012X65]  108.39,34.11 180 bottom
R17  10k  [RESC2012X65]  121.46,35.4 169 bottom
R18  10k  [RESC2012X65]  132.92,37.92 338 bottom
R19  10k  [RESC2012X65]  145.62,45.4 146 bottom
R20  10k  [RESC2012X65]  155.77,53.74 135 bottom
R21  10k  [RESC2012X65]  164.1,63.89 124 bottom
R22  10k  [RESC2012X65]  174.41,77.45 113 bottom
R23  10k  [RESC2012X65]  174.1,88.04 101 bottom
R24  10k  [RESC2012X65]  175.39,101.11 90 bottom
R25  10k  [RESC2012X65]  174.1,114.18 79 bottom
R26  10k  [RESC2012X65]  174.13,124.37 247 bottom
R27  10k  [RESC2012X65]  164.1,138.34 56 bottom
R28  10k  [RESC2012X65]  155.77,148.49 45 bottom
R29  10k  [RESC2012X65]  145.62,156.82 34 bottom
R30  10k  [RESC2012X65]  133.4,163.65 23 bottom
R31  10k  [RESC2012X65]  122.1,166.82 191 bottom
R32  10k  [RESC2012X65]  113.39,110.11 90 bottom
R33  10k  [RESC2012X65]  113.39,127.61 90 bottom
R34  10k  [RESC2012X65]  113.39,145.11 90 bottom
R35  10k  [RESC2012X65]  113.39,161.34 270 bottom
R36  10k  [RESC2012X65]  99.39,106.11 0 bottom
R37  10k  [RESC2012X65]  81.89,106.11 0 bottom
R38  10k  [RESC2012X65]  64.39,106.11 0 bottom
R39  10k  [RESC2012X65]  46.89,106.11 180 bottom
R40  10k  [RESC2012X65]  103.39,92.11 270 bottom
R41  10k  [RESC2012X65]  103.39,74.61 270 bottom
R42  10k  [RESC2012X65]  103.39,57.11 270 bottom
R43  10k  [RESC2012X65]  103.39,39.61 90 bottom
R44  10k  [RESC2012X65]  117.39,106.11 180 bottom
R45  10k  [RESC2012X65]  134.89,106.11 180 bottom
R46  10k  [RESC2012X65]  152.39,106.11 180 bottom
R47  10k  [RESC2012X65]  169.89,106.11 0 bottom
R48  4R7  [RESC2012X65]  96.17,101.65 90 top
R49  4R7  [RESC2012X65]  98.23,99.84 270 top
R97  100k  [RESC2012X65]  84.9,99.84 270 top
R98  100k  [RESC2012X65]  84.9,103.02 90 top
XMUX  CD74HC4067SM96  [SOP65P780X200-24N]  109.57,101.85 270 top